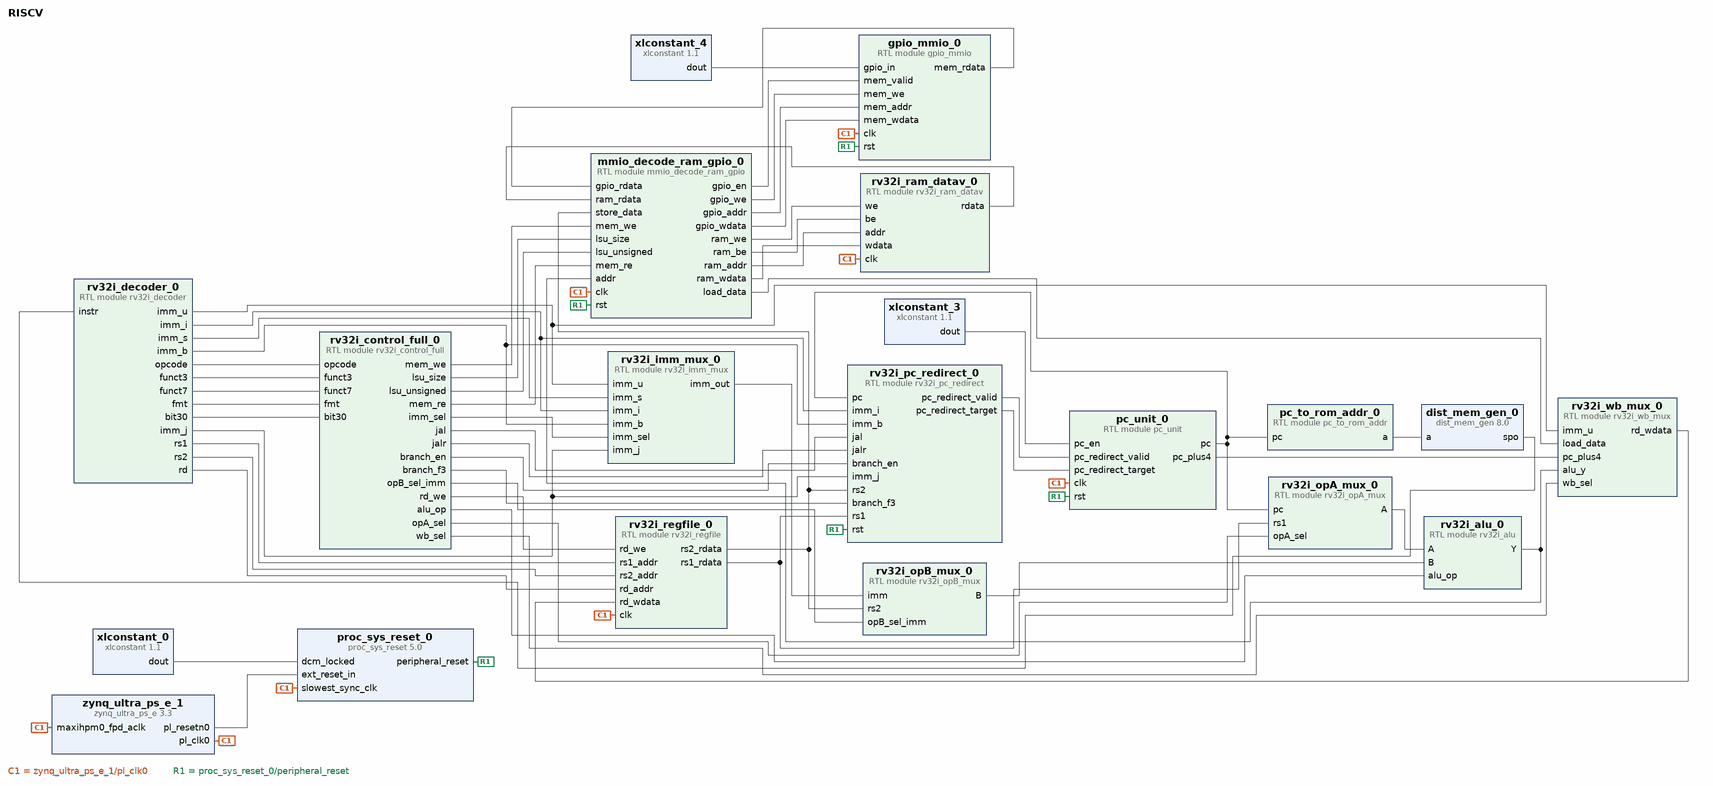
[diagram p0: block diagram of the top level]
# Vivado block design RISCV, xczu5ev-sfvc784-2-i, Vivado 2020.1
create_bd_design RISCV

create_bd_cell -type ip -vlnv xilinx.com:ip:dist_mem_gen:8.0 dist_mem_gen_0
set_property -dict [list \
  CONFIG.coefficient_file ../../../../../../../../rv32i_vscode/prog.coe \
  CONFIG.data_width 32 \
  CONFIG.depth 1024 \
  CONFIG.memory_type rom \
] [get_bd_cells dist_mem_gen_0]
create_bd_cell -type ip -vlnv xilinx.com:ip:proc_sys_reset:5.0 proc_sys_reset_0
set_property -dict {CONFIG.C_AUX_RESET_HIGH 0} [get_bd_cells proc_sys_reset_0]
create_bd_cell -type module -reference rv32i_alu rv32i_alu_0
create_bd_cell -type module -reference rv32i_control_full rv32i_control_full_0
create_bd_cell -type module -reference rv32i_imm_mux rv32i_imm_mux_0
create_bd_cell -type module -reference rv32i_opA_mux rv32i_opA_mux_0
create_bd_cell -type module -reference rv32i_opB_mux rv32i_opB_mux_0
create_bd_cell -type module -reference rv32i_regfile rv32i_regfile_0
create_bd_cell -type module -reference rv32i_wb_mux rv32i_wb_mux_0
create_bd_cell -type ip -vlnv xilinx.com:ip:xlconstant:1.1 xlconstant_0
create_bd_cell -type ip -vlnv xilinx.com:ip:xlconstant:1.1 xlconstant_3
create_bd_cell -type ip -vlnv xilinx.com:ip:zynq_ultra_ps_e:3.3 zynq_ultra_ps_e_1
set_property -dict [list \
  CONFIG.CAN0_BOARD_INTERFACE custom \
  CONFIG.CAN1_BOARD_INTERFACE custom \
  CONFIG.CSU_BOARD_INTERFACE custom \
  CONFIG.DP_BOARD_INTERFACE custom \
  CONFIG.GEM0_BOARD_INTERFACE custom \
  CONFIG.GEM1_BOARD_INTERFACE custom \
  CONFIG.GEM2_BOARD_INTERFACE custom \
  CONFIG.GEM3_BOARD_INTERFACE custom \
  CONFIG.GPIO_BOARD_INTERFACE custom \
  CONFIG.IIC0_BOARD_INTERFACE custom \
  CONFIG.IIC1_BOARD_INTERFACE custom \
  CONFIG.NAND_BOARD_INTERFACE custom \
  CONFIG.PCIE_BOARD_INTERFACE custom \
  CONFIG.PJTAG_BOARD_INTERFACE custom \
  CONFIG.PMU_BOARD_INTERFACE custom \
  CONFIG.PSU_BANK_0_IO_STANDARD LVCMOS18 \
  CONFIG.PSU_BANK_1_IO_STANDARD LVCMOS18 \
  CONFIG.PSU_BANK_2_IO_STANDARD LVCMOS18 \
  CONFIG.PSU_BANK_3_IO_STANDARD LVCMOS18 \
  CONFIG.PSU_USB3__DUAL_CLOCK_ENABLE 1 \
  CONFIG.PSU__CAN0__PERIPHERAL__ENABLE 1 \
  CONFIG.PSU__CAN0__PERIPHERAL__IO EMIO \
  CONFIG.PSU__CAN1__PERIPHERAL__ENABLE 0 \
  CONFIG.PSU__CRF_APB__ACPU_CTRL__FREQMHZ 1200 \
  CONFIG.PSU__CRF_APB__ACPU_CTRL__SRCSEL APLL \
  CONFIG.PSU__CRF_APB__APLL_CTRL__SRCSEL PSS_REF_CLK \
  CONFIG.PSU__CRF_APB__DBG_FPD_CTRL__FREQMHZ 250 \
  CONFIG.PSU__CRF_APB__DBG_FPD_CTRL__SRCSEL IOPLL \
  CONFIG.PSU__CRF_APB__DBG_TRACE_CTRL__FREQMHZ 250 \
  CONFIG.PSU__CRF_APB__DBG_TRACE_CTRL__SRCSEL IOPLL \
  CONFIG.PSU__CRF_APB__DBG_TSTMP_CTRL__FREQMHZ 250 \
  CONFIG.PSU__CRF_APB__DBG_TSTMP_CTRL__SRCSEL IOPLL \
  CONFIG.PSU__CRF_APB__DDR_CTRL__FREQMHZ 1200 \
  CONFIG.PSU__CRF_APB__DDR_CTRL__SRCSEL DPLL \
  CONFIG.PSU__CRF_APB__DPDMA_REF_CTRL__FREQMHZ 600 \
  CONFIG.PSU__CRF_APB__DPDMA_REF_CTRL__SRCSEL DPLL \
  CONFIG.PSU__CRF_APB__DPLL_CTRL__SRCSEL PSS_REF_CLK \
  CONFIG.PSU__CRF_APB__DP_AUDIO_REF_CTRL__SRCSEL RPLL \
  CONFIG.PSU__CRF_APB__DP_STC_REF_CTRL__SRCSEL RPLL \
  CONFIG.PSU__CRF_APB__DP_VIDEO_REF_CTRL__SRCSEL VPLL \
  CONFIG.PSU__CRF_APB__GDMA_REF_CTRL__FREQMHZ 600 \
  CONFIG.PSU__CRF_APB__GDMA_REF_CTRL__SRCSEL DPLL \
  CONFIG.PSU__CRF_APB__GPU_REF_CTRL__FREQMHZ 600 \
  CONFIG.PSU__CRF_APB__GPU_REF_CTRL__SRCSEL DPLL \
  CONFIG.PSU__CRF_APB__TOPSW_LSBUS_CTRL__FREQMHZ 100 \
  CONFIG.PSU__CRF_APB__TOPSW_LSBUS_CTRL__SRCSEL IOPLL \
  CONFIG.PSU__CRF_APB__TOPSW_MAIN_CTRL__FREQMHZ 533.333 \
  CONFIG.PSU__CRF_APB__TOPSW_MAIN_CTRL__SRCSEL DPLL \
  CONFIG.PSU__CRF_APB__VPLL_CTRL__SRCSEL PSS_REF_CLK \
  CONFIG.PSU__CRL_APB__ADMA_REF_CTRL__FREQMHZ 500 \
  CONFIG.PSU__CRL_APB__ADMA_REF_CTRL__SRCSEL IOPLL \
  CONFIG.PSU__CRL_APB__CAN1_REF_CTRL__FREQMHZ 100 \
  CONFIG.PSU__CRL_APB__CAN1_REF_CTRL__SRCSEL IOPLL \
  CONFIG.PSU__CRL_APB__CPU_R5_CTRL__FREQMHZ 500 \
  CONFIG.PSU__CRL_APB__CPU_R5_CTRL__SRCSEL IOPLL \
  CONFIG.PSU__CRL_APB__DBG_LPD_CTRL__FREQMHZ 250 \
  CONFIG.PSU__CRL_APB__DBG_LPD_CTRL__SRCSEL IOPLL \
  CONFIG.PSU__CRL_APB__GEM3_REF_CTRL__FREQMHZ 125 \
  CONFIG.PSU__CRL_APB__GEM3_REF_CTRL__SRCSEL IOPLL \
  CONFIG.PSU__CRL_APB__I2C0_REF_CTRL__FREQMHZ 100 \
  CONFIG.PSU__CRL_APB__I2C0_REF_CTRL__SRCSEL IOPLL \
  CONFIG.PSU__CRL_APB__I2C1_REF_CTRL__FREQMHZ 100 \
  CONFIG.PSU__CRL_APB__I2C1_REF_CTRL__SRCSEL IOPLL \
  CONFIG.PSU__CRL_APB__IOPLL_CTRL__SRCSEL PSS_REF_CLK \
  CONFIG.PSU__CRL_APB__IOU_SWITCH_CTRL__FREQMHZ 267 \
  CONFIG.PSU__CRL_APB__IOU_SWITCH_CTRL__SRCSEL RPLL \
  CONFIG.PSU__CRL_APB__LPD_LSBUS_CTRL__FREQMHZ 100 \
  CONFIG.PSU__CRL_APB__LPD_LSBUS_CTRL__SRCSEL IOPLL \
  CONFIG.PSU__CRL_APB__LPD_SWITCH_CTRL__FREQMHZ 500 \
  CONFIG.PSU__CRL_APB__LPD_SWITCH_CTRL__SRCSEL IOPLL \
  CONFIG.PSU__CRL_APB__PCAP_CTRL__FREQMHZ 200 \
  CONFIG.PSU__CRL_APB__PCAP_CTRL__SRCSEL IOPLL \
  CONFIG.PSU__CRL_APB__PL0_REF_CTRL__FREQMHZ 100 \
  CONFIG.PSU__CRL_APB__PL0_REF_CTRL__SRCSEL RPLL \
  CONFIG.PSU__CRL_APB__QSPI_REF_CTRL__FREQMHZ 300 \
  CONFIG.PSU__CRL_APB__QSPI_REF_CTRL__SRCSEL IOPLL \
  CONFIG.PSU__CRL_APB__RPLL_CTRL__SRCSEL PSS_REF_CLK \
  CONFIG.PSU__CRL_APB__SDIO1_REF_CTRL__FREQMHZ 200 \
  CONFIG.PSU__CRL_APB__SDIO1_REF_CTRL__SRCSEL RPLL \
  CONFIG.PSU__CRL_APB__TIMESTAMP_REF_CTRL__FREQMHZ 100 \
  CONFIG.PSU__CRL_APB__TIMESTAMP_REF_CTRL__SRCSEL PSS_REF_CLK \
  CONFIG.PSU__CRL_APB__UART0_REF_CTRL__FREQMHZ 100 \
  CONFIG.PSU__CRL_APB__UART0_REF_CTRL__SRCSEL IOPLL \
  CONFIG.PSU__CRL_APB__UART1_REF_CTRL__FREQMHZ 100 \
  CONFIG.PSU__CRL_APB__UART1_REF_CTRL__SRCSEL IOPLL \
  CONFIG.PSU__CRL_APB__USB0_BUS_REF_CTRL__FREQMHZ 250 \
  CONFIG.PSU__CRL_APB__USB0_BUS_REF_CTRL__SRCSEL IOPLL \
  CONFIG.PSU__CRL_APB__USB3_DUAL_REF_CTRL__FREQMHZ 20 \
  CONFIG.PSU__CRL_APB__USB3_DUAL_REF_CTRL__SRCSEL IOPLL \
  CONFIG.PSU__CRL_APB__USB3__ENABLE 1 \
  CONFIG.PSU__CSUPMU__PERIPHERAL__VALID 0 \
  CONFIG.PSU__DDRC__BUS_WIDTH {64 Bit} \
  CONFIG.PSU__DDRC__COMPONENTS Components \
  CONFIG.PSU__DDRC__DEVICE_CAPACITY {8192 MBits} \
  CONFIG.PSU__DDRC__DRAM_WIDTH {16 Bits} \
  CONFIG.PSU__DDRC__ECC Disabled \
  CONFIG.PSU__DDRC__MEMORY_TYPE {DDR 4} \
  CONFIG.PSU__DDRC__SPEED_BIN DDR4_2400R \
  CONFIG.PSU__DDR_HIGH_ADDRESS_GUI_ENABLE 1 \
  CONFIG.PSU__DDR__INTERFACE__FREQMHZ 600.000 \
  CONFIG.PSU__DEVICE_TYPE EV \
  CONFIG.PSU__DISPLAYPORT__LANE0__ENABLE 1 \
  CONFIG.PSU__DISPLAYPORT__LANE0__IO {GT Lane3} \
  CONFIG.PSU__DISPLAYPORT__LANE1__ENABLE 0 \
  CONFIG.PSU__DISPLAYPORT__PERIPHERAL__ENABLE 1 \
  CONFIG.PSU__DLL__ISUSED 1 \
  CONFIG.PSU__DPAUX__PERIPHERAL__ENABLE 1 \
  CONFIG.PSU__DPAUX__PERIPHERAL__IO {MIO 27 .. 30} \
  CONFIG.PSU__DP__LANE_SEL {Single Higher} \
  CONFIG.PSU__DP__REF_CLK_FREQ 108 \
  CONFIG.PSU__DP__REF_CLK_SEL {Ref Clk3} \
  CONFIG.PSU__ENET3__FIFO__ENABLE 0 \
  CONFIG.PSU__ENET3__GRP_MDIO__ENABLE 1 \
  CONFIG.PSU__ENET3__GRP_MDIO__IO {MIO 76 .. 77} \
  CONFIG.PSU__ENET3__PERIPHERAL__ENABLE 1 \
  CONFIG.PSU__ENET3__PERIPHERAL__IO {MIO 64 .. 75} \
  CONFIG.PSU__ENET3__PTP__ENABLE 0 \
  CONFIG.PSU__ENET3__TSU__ENABLE 0 \
  CONFIG.PSU__FPGA_PL0_ENABLE 1 \
  CONFIG.PSU__FPGA_PL1_ENABLE 1 \
  CONFIG.PSU__GEM3_COHERENCY 0 \
  CONFIG.PSU__GEM3_ROUTE_THROUGH_FPD 0 \
  CONFIG.PSU__GEM__TSU__ENABLE 0 \
  CONFIG.PSU__GPIO0_MIO__IO {MIO 0 .. 25} \
  CONFIG.PSU__GPIO0_MIO__PERIPHERAL__ENABLE 1 \
  CONFIG.PSU__GPIO1_MIO__IO {MIO 26 .. 51} \
  CONFIG.PSU__GPIO1_MIO__PERIPHERAL__ENABLE 1 \
  CONFIG.PSU__GPIO_EMIO_WIDTH 95 \
  CONFIG.PSU__GPIO_EMIO__PERIPHERAL__ENABLE 1 \
  CONFIG.PSU__GPIO_EMIO__PERIPHERAL__IO 95 \
  CONFIG.PSU__GT__LINK_SPEED HBR \
  CONFIG.PSU__GT__PRE_EMPH_LVL_4 0 \
  CONFIG.PSU__GT__VLT_SWNG_LVL_4 0 \
  CONFIG.PSU__I2C0__PERIPHERAL__ENABLE 1 \
  CONFIG.PSU__I2C0__PERIPHERAL__IO EMIO \
  CONFIG.PSU__I2C1__PERIPHERAL__ENABLE 1 \
  CONFIG.PSU__I2C1__PERIPHERAL__IO {MIO 24 .. 25} \
  CONFIG.PSU__IOU_SLCR__IOU_TTC_APB_CLK__TTC0_SEL APB \
  CONFIG.PSU__IOU_SLCR__IOU_TTC_APB_CLK__TTC1_SEL APB \
  CONFIG.PSU__IOU_SLCR__IOU_TTC_APB_CLK__TTC2_SEL APB \
  CONFIG.PSU__IOU_SLCR__IOU_TTC_APB_CLK__TTC3_SEL APB \
  CONFIG.PSU__LPD_SLCR__CSUPMU__FREQMHZ 100 \
  CONFIG.PSU__MAXIGP0__DATA_WIDTH 32 \
  CONFIG.PSU__OVERRIDE_HPX_QOS 0 \
  CONFIG.PSU__OVERRIDE__BASIC_CLOCK 0 \
  CONFIG.PSU__PMU__PERIPHERAL__ENABLE 0 \
  CONFIG.PSU__PRESET_APPLIED 0 \
  CONFIG.PSU__PSS_REF_CLK__FREQMHZ 33.333 \
  CONFIG.PSU__QSPI_COHERENCY 0 \
  CONFIG.PSU__QSPI_ROUTE_THROUGH_FPD 0 \
  CONFIG.PSU__QSPI__GRP_FBCLK__ENABLE 0 \
  CONFIG.PSU__QSPI__PERIPHERAL__DATA_MODE x4 \
  CONFIG.PSU__QSPI__PERIPHERAL__ENABLE 1 \
  CONFIG.PSU__QSPI__PERIPHERAL__IO {MIO 0 .. 12} \
  CONFIG.PSU__QSPI__PERIPHERAL__MODE {Dual Parallel} \
  CONFIG.PSU__SATA__LANE1__IO {GT Lane1} \
  CONFIG.PSU__SATA__PERIPHERAL__ENABLE 1 \
  CONFIG.PSU__SATA__REF_CLK_FREQ 125 \
  CONFIG.PSU__SATA__REF_CLK_SEL {Ref Clk1} \
  CONFIG.PSU__SD0__DATA_TRANSFER_MODE 8Bit \
  CONFIG.PSU__SD0__GRP_POW__ENABLE 1 \
  CONFIG.PSU__SD0__GRP_POW__IO {MIO 23} \
  CONFIG.PSU__SD0__PERIPHERAL__ENABLE 1 \
  CONFIG.PSU__SD0__PERIPHERAL__IO {MIO 13 .. 22} \
  CONFIG.PSU__SD0__RESET__ENABLE 1 \
  CONFIG.PSU__SD0__SLOT_TYPE eMMC \
  CONFIG.PSU__SD1_COHERENCY 0 \
  CONFIG.PSU__SD1_ROUTE_THROUGH_FPD 0 \
  CONFIG.PSU__SD1__DATA_TRANSFER_MODE 4Bit \
  CONFIG.PSU__SD1__GRP_CD__ENABLE 1 \
  CONFIG.PSU__SD1__GRP_CD__IO {MIO 45} \
  CONFIG.PSU__SD1__GRP_POW__ENABLE 0 \
  CONFIG.PSU__SD1__GRP_WP__ENABLE 1 \
  CONFIG.PSU__SD1__GRP_WP__IO {MIO 44} \
  CONFIG.PSU__SD1__PERIPHERAL__ENABLE 1 \
  CONFIG.PSU__SD1__PERIPHERAL__IO {MIO 46 .. 51} \
  CONFIG.PSU__SD1__SLOT_TYPE {SD 2.0} \
  CONFIG.PSU__SWDT0__CLOCK__ENABLE 0 \
  CONFIG.PSU__SWDT0__PERIPHERAL__ENABLE 1 \
  CONFIG.PSU__SWDT0__RESET__ENABLE 0 \
  CONFIG.PSU__SWDT1__CLOCK__ENABLE 0 \
  CONFIG.PSU__SWDT1__PERIPHERAL__ENABLE 1 \
  CONFIG.PSU__SWDT1__RESET__ENABLE 0 \
  CONFIG.PSU__TSU__BUFG_PORT_PAIR 0 \
  CONFIG.PSU__TTC0__CLOCK__ENABLE 0 \
  CONFIG.PSU__TTC0__PERIPHERAL__ENABLE 1 \
  CONFIG.PSU__TTC0__WAVEOUT__ENABLE 0 \
  CONFIG.PSU__TTC1__CLOCK__ENABLE 0 \
  CONFIG.PSU__TTC1__PERIPHERAL__ENABLE 1 \
  CONFIG.PSU__TTC1__WAVEOUT__ENABLE 0 \
  CONFIG.PSU__TTC2__CLOCK__ENABLE 0 \
  CONFIG.PSU__TTC2__PERIPHERAL__ENABLE 1 \
  CONFIG.PSU__TTC2__WAVEOUT__ENABLE 0 \
  CONFIG.PSU__TTC3__CLOCK__ENABLE 0 \
  CONFIG.PSU__TTC3__PERIPHERAL__ENABLE 1 \
  CONFIG.PSU__TTC3__WAVEOUT__ENABLE 0 \
  CONFIG.PSU__UART0__BAUD_RATE 115200 \
  CONFIG.PSU__UART0__MODEM__ENABLE 0 \
  CONFIG.PSU__UART0__PERIPHERAL__ENABLE 1 \
  CONFIG.PSU__UART0__PERIPHERAL__IO {MIO 34 .. 35} \
  CONFIG.PSU__UART1__PERIPHERAL__ENABLE 0 \
  CONFIG.PSU__USB0_COHERENCY 0 \
  CONFIG.PSU__USB0__PERIPHERAL__ENABLE 1 \
  CONFIG.PSU__USB0__PERIPHERAL__IO {MIO 52 .. 63} \
  CONFIG.PSU__USB0__REF_CLK_FREQ 52 \
  CONFIG.PSU__USB0__REF_CLK_SEL {Ref Clk2} \
  CONFIG.PSU__USB2_0__EMIO__ENABLE 0 \
  CONFIG.PSU__USB3_0__EMIO__ENABLE 0 \
  CONFIG.PSU__USB3_0__PERIPHERAL__ENABLE 1 \
  CONFIG.PSU__USB3_0__PERIPHERAL__IO {GT Lane2} \
  CONFIG.PSU__USB__RESET__MODE {Boot Pin} \
  CONFIG.PSU__USB__RESET__POLARITY {Active Low} \
  CONFIG.PSU__USE__IRQ0 0 \
  CONFIG.PSU__USE__M_AXI_GP0 1 \
  CONFIG.PSU__USE__M_AXI_GP1 0 \
  CONFIG.PSU__USE__M_AXI_GP2 0 \
  CONFIG.QSPI_BOARD_INTERFACE custom \
  CONFIG.SATA_BOARD_INTERFACE custom \
  CONFIG.SD0_BOARD_INTERFACE custom \
  CONFIG.SD1_BOARD_INTERFACE custom \
  CONFIG.SPI0_BOARD_INTERFACE custom \
  CONFIG.SPI1_BOARD_INTERFACE custom \
  CONFIG.SUBPRESET1 Custom \
  CONFIG.SUBPRESET2 Custom \
  CONFIG.SWDT0_BOARD_INTERFACE custom \
  CONFIG.SWDT1_BOARD_INTERFACE custom \
  CONFIG.TRACE_BOARD_INTERFACE custom \
  CONFIG.TTC0_BOARD_INTERFACE custom \
  CONFIG.TTC1_BOARD_INTERFACE custom \
  CONFIG.TTC2_BOARD_INTERFACE custom \
  CONFIG.TTC3_BOARD_INTERFACE custom \
  CONFIG.UART0_BOARD_INTERFACE custom \
  CONFIG.UART1_BOARD_INTERFACE custom \
  CONFIG.USB0_BOARD_INTERFACE custom \
  CONFIG.USB1_BOARD_INTERFACE custom \
] [get_bd_cells zynq_ultra_ps_e_1]
# 741 more settings of zynq_ultra_ps_e_1 are not shown: defaults, MIO pin electricals, DDR timing, and values the tool derives
create_bd_cell -type ip -vlnv xilinx.com:ip:xlconstant:1.1 xlconstant_4
set_property -dict {CONFIG.CONST_WIDTH 32} [get_bd_cells xlconstant_4]
create_bd_cell -type module -reference rv32i_decoder rv32i_decoder_0
create_bd_cell -type module -reference mmio_decode_ram_gpio mmio_decode_ram_gpio_0
create_bd_cell -type module -reference rv32i_pc_redirect rv32i_pc_redirect_0
create_bd_cell -type module -reference gpio_mmio gpio_mmio_0
create_bd_cell -type module -reference rv32i_ram_datav rv32i_ram_datav_0
create_bd_cell -type module -reference pc_to_rom_addr pc_to_rom_addr_0
set_property -dict {CONFIG.ADDR_W 10} [get_bd_cells pc_to_rom_addr_0]
create_bd_cell -type module -reference pc_unit pc_unit_0

# ---- connections ----

connect_bd_net [get_bd_pins xlconstant_0/dout] [get_bd_pins proc_sys_reset_0/dcm_locked]
connect_bd_net [get_bd_pins pc_unit_0/pc] [get_bd_pins rv32i_opA_mux_0/pc] [get_bd_pins rv32i_pc_redirect_0/pc] [get_bd_pins pc_to_rom_addr_0/pc]
connect_bd_net [get_bd_pins rv32i_decoder_0/rs1] [get_bd_pins rv32i_regfile_0/rs1_addr]
connect_bd_net [get_bd_pins rv32i_decoder_0/rs2] [get_bd_pins rv32i_regfile_0/rs2_addr]
connect_bd_net [get_bd_pins rv32i_decoder_0/rd] [get_bd_pins rv32i_regfile_0/rd_addr]
connect_bd_net [get_bd_pins rv32i_decoder_0/opcode] [get_bd_pins rv32i_control_full_0/opcode]
connect_bd_net [get_bd_pins rv32i_decoder_0/funct3] [get_bd_pins rv32i_control_full_0/funct3]
connect_bd_net [get_bd_pins rv32i_decoder_0/funct7] [get_bd_pins rv32i_control_full_0/funct7]
connect_bd_net [get_bd_pins rv32i_decoder_0/fmt] [get_bd_pins rv32i_control_full_0/fmt]
connect_bd_net [get_bd_pins rv32i_decoder_0/bit30] [get_bd_pins rv32i_control_full_0/bit30]
connect_bd_net [get_bd_pins rv32i_regfile_0/rs2_rdata] \
  [get_bd_pins rv32i_opB_mux_0/rs2] [get_bd_pins mmio_decode_ram_gpio_0/store_data] [get_bd_pins rv32i_pc_redirect_0/rs2]
connect_bd_net [get_bd_pins rv32i_control_full_0/mem_we] [get_bd_pins mmio_decode_ram_gpio_0/mem_we]
connect_bd_net [get_bd_pins rv32i_control_full_0/lsu_size] [get_bd_pins mmio_decode_ram_gpio_0/lsu_size]
connect_bd_net [get_bd_pins rv32i_control_full_0/lsu_unsigned] [get_bd_pins mmio_decode_ram_gpio_0/lsu_unsigned]
connect_bd_net [get_bd_pins rv32i_regfile_0/rs1_rdata] [get_bd_pins rv32i_opA_mux_0/rs1] [get_bd_pins rv32i_pc_redirect_0/rs1]
connect_bd_net [get_bd_pins rv32i_control_full_0/mem_re] [get_bd_pins mmio_decode_ram_gpio_0/mem_re]
connect_bd_net [get_bd_pins rv32i_decoder_0/imm_i] [get_bd_pins rv32i_imm_mux_0/imm_i] [get_bd_pins rv32i_pc_redirect_0/imm_i]
connect_bd_net [get_bd_pins rv32i_decoder_0/imm_s] [get_bd_pins rv32i_imm_mux_0/imm_s]
connect_bd_net [get_bd_pins rv32i_control_full_0/alu_op] [get_bd_pins rv32i_alu_0/alu_op]
connect_bd_net [get_bd_pins rv32i_alu_0/Y] [get_bd_pins rv32i_wb_mux_0/alu_y] [get_bd_pins mmio_decode_ram_gpio_0/addr]
connect_bd_net [get_bd_pins rv32i_control_full_0/wb_sel] [get_bd_pins rv32i_wb_mux_0/wb_sel]
connect_bd_net [get_bd_pins pc_unit_0/pc_plus4] [get_bd_pins rv32i_wb_mux_0/pc_plus4]
connect_bd_net [get_bd_pins rv32i_decoder_0/imm_u] [get_bd_pins rv32i_imm_mux_0/imm_u] [get_bd_pins rv32i_wb_mux_0/imm_u]
connect_bd_net [get_bd_pins rv32i_wb_mux_0/rd_wdata] [get_bd_pins rv32i_regfile_0/rd_wdata]
connect_bd_net [get_bd_pins rv32i_control_full_0/rd_we] [get_bd_pins rv32i_regfile_0/rd_we]
connect_bd_net [get_bd_pins rv32i_decoder_0/imm_b] [get_bd_pins rv32i_imm_mux_0/imm_b] [get_bd_pins rv32i_pc_redirect_0/imm_b]
connect_bd_net [get_bd_pins rv32i_decoder_0/imm_j] [get_bd_pins rv32i_imm_mux_0/imm_j] [get_bd_pins rv32i_pc_redirect_0/imm_j]
connect_bd_net [get_bd_pins rv32i_control_full_0/jal] [get_bd_pins rv32i_pc_redirect_0/jal]
connect_bd_net [get_bd_pins rv32i_control_full_0/jalr] [get_bd_pins rv32i_pc_redirect_0/jalr]
connect_bd_net [get_bd_pins rv32i_control_full_0/branch_en] [get_bd_pins rv32i_pc_redirect_0/branch_en]
connect_bd_net [get_bd_pins rv32i_control_full_0/branch_f3] [get_bd_pins rv32i_pc_redirect_0/branch_f3]
connect_bd_net [get_bd_pins rv32i_pc_redirect_0/pc_redirect_valid] [get_bd_pins pc_unit_0/pc_redirect_valid]
connect_bd_net [get_bd_pins rv32i_control_full_0/imm_sel] [get_bd_pins rv32i_imm_mux_0/imm_sel]
connect_bd_net [get_bd_pins rv32i_control_full_0/opA_sel] [get_bd_pins rv32i_opA_mux_0/opA_sel]
connect_bd_net [get_bd_pins rv32i_imm_mux_0/imm_out] [get_bd_pins rv32i_opB_mux_0/imm]
connect_bd_net [get_bd_pins rv32i_control_full_0/opB_sel_imm] [get_bd_pins rv32i_opB_mux_0/opB_sel_imm]
connect_bd_net [get_bd_pins rv32i_opA_mux_0/A] [get_bd_pins rv32i_alu_0/A]
connect_bd_net [get_bd_pins rv32i_opB_mux_0/B] [get_bd_pins rv32i_alu_0/B]
connect_bd_net [get_bd_pins dist_mem_gen_0/spo] [get_bd_pins rv32i_decoder_0/instr]
connect_bd_net [get_bd_pins mmio_decode_ram_gpio_0/ram_we] [get_bd_pins rv32i_ram_datav_0/we]
connect_bd_net [get_bd_pins mmio_decode_ram_gpio_0/ram_be] [get_bd_pins rv32i_ram_datav_0/be]
connect_bd_net [get_bd_pins mmio_decode_ram_gpio_0/ram_addr] [get_bd_pins rv32i_ram_datav_0/addr]
connect_bd_net [get_bd_pins mmio_decode_ram_gpio_0/ram_wdata] [get_bd_pins rv32i_ram_datav_0/wdata]
connect_bd_net [get_bd_pins mmio_decode_ram_gpio_0/gpio_en] [get_bd_pins gpio_mmio_0/mem_valid]
connect_bd_net [get_bd_pins mmio_decode_ram_gpio_0/gpio_we] [get_bd_pins gpio_mmio_0/mem_we]
connect_bd_net [get_bd_pins mmio_decode_ram_gpio_0/gpio_addr] [get_bd_pins gpio_mmio_0/mem_addr]
connect_bd_net [get_bd_pins mmio_decode_ram_gpio_0/gpio_wdata] [get_bd_pins gpio_mmio_0/mem_wdata]
connect_bd_net [get_bd_pins mmio_decode_ram_gpio_0/load_data] [get_bd_pins rv32i_wb_mux_0/load_data]
connect_bd_net [get_bd_pins rv32i_ram_datav_0/rdata] [get_bd_pins mmio_decode_ram_gpio_0/ram_rdata]
connect_bd_net [get_bd_pins gpio_mmio_0/mem_rdata] [get_bd_pins mmio_decode_ram_gpio_0/gpio_rdata]
connect_bd_net [get_bd_pins zynq_ultra_ps_e_1/pl_clk0] \
  [get_bd_pins rv32i_regfile_0/clk] [get_bd_pins mmio_decode_ram_gpio_0/clk] [get_bd_pins proc_sys_reset_0/slowest_sync_clk] \
  [get_bd_pins zynq_ultra_ps_e_1/maxihpm0_fpd_aclk] [get_bd_pins gpio_mmio_0/clk] [get_bd_pins rv32i_ram_datav_0/clk] \
  [get_bd_pins pc_unit_0/clk]
connect_bd_net [get_bd_pins xlconstant_4/dout] [get_bd_pins gpio_mmio_0/gpio_in]
connect_bd_net [get_bd_pins pc_to_rom_addr_0/a] [get_bd_pins dist_mem_gen_0/a]
connect_bd_net [get_bd_pins zynq_ultra_ps_e_1/pl_resetn0] [get_bd_pins proc_sys_reset_0/ext_reset_in]
connect_bd_net [get_bd_pins rv32i_pc_redirect_0/pc_redirect_target] [get_bd_pins pc_unit_0/pc_redirect_target]
connect_bd_net [get_bd_pins proc_sys_reset_0/peripheral_reset] \
  [get_bd_pins mmio_decode_ram_gpio_0/rst] [get_bd_pins rv32i_pc_redirect_0/rst] [get_bd_pins gpio_mmio_0/rst] \
  [get_bd_pins pc_unit_0/rst]
connect_bd_net [get_bd_pins xlconstant_3/dout] [get_bd_pins pc_unit_0/pc_en]

validate_bd_design
save_bd_design
